# Altium schematic sheet S1_Connections.SchDoc
size A4
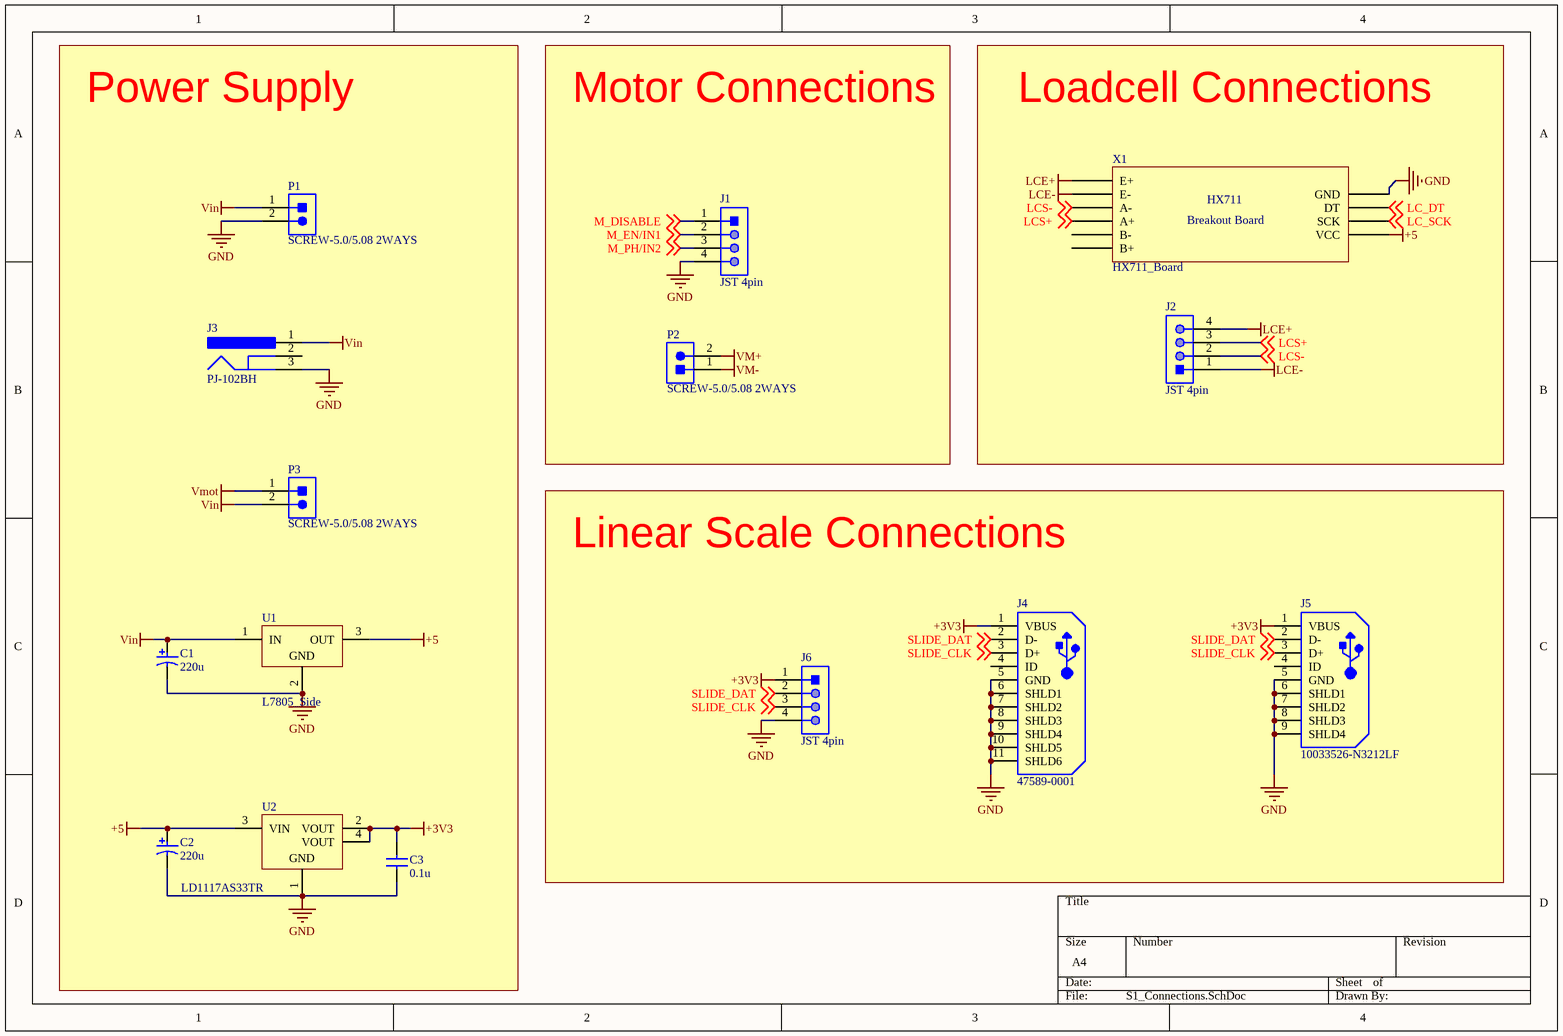
[diagram p0: S1_Connections.SchDoc]

## Parts
C1  220u  [Alu Cap 6.3x2.5mm]
C2  220u  [Alu Cap 6.3x2.5mm]
C3  0.1u  [Ceramic Cap 5mm]
J1  JST 4pin  [4Pin JST]
J2  JST 4pin  [4Pin JST]
J3  PJ-102BH  [CUI-PJ-102BH_V]
J4  47589-0001  [MOLX-47589-0001_V]
J5  10033526-N3212LF  [FCI-10033526-N3212LF_V]
J6  JST 4pin  [4Pin JST]
P1  SCREW-5.0/5.08 2WAYS  [SCREW-5.0-2WAYS_V]
P2  SCREW-5.0/5.08 2WAYS  [SCREW-5.0-2WAYS_V]
P3  SCREW-5.0/5.08 2WAYS  [SCREW-5.0-2WAYS_V]
U1  L7805_Side  [TO220_Side Mount]
U2  LD1117AS33TR  [SOT-223_M]
X1  HX711_Board  [HX711_Board_Large]

## Blocks framed on the sheet
Power Supply: C1-C3 J3 P1 P3 U1 U2
Motor Connections: J1 P2
Loadcell Connections: J2 X1
Linear Scale Connections: J4-J6

## Nets
+3V3: C3.1 J4.1(VBUS) J5.1(VBUS) J6.1 U2.2(VOUT) U2.4(VOUT)
+5: C2.1 U1.3(OUT) U2.3(VIN) X1.7(VCC)
GND: C1.2 C2.2 C3.2 J1.4 J3.3 J4.5(GND) J4.6(SHLD1) J4.7(SHLD2) J4.8(SHLD3) J4.9(SHLD4) J4.10(SHLD5) J4.11(SHLD6) J5.5(GND) J5.6(SHLD1) J5.7(SHLD2) J5.8(SHLD3) J5.9(SHLD4) J6.4 P1.2 U1.2(GND) U2.1(GND) X1.10(GND)
LCE+: J2.4 X1.1(E+)
LCE-: J2.1 X1.2(E-)
Vin: C1.1 J3.1 P1.1 P3.2 U1.1(IN)
VM+: P2.2
VM-: P2.1
Vmot: P3.1
LC_DT: X1.9(DT) ; off-sheet LC_DT
LC_SCK: X1.8(SCK) ; off-sheet LC_SCK
LCS+: J2.3 X1.4(A+) ; off-sheet LCS+
LCS-: J2.2 X1.3(A-) ; off-sheet LCS-
M_DISABLE: J1.1 ; off-sheet M_DISABLE
M_EN/IN1: J1.2 ; off-sheet M_EN/IN1
M_PH/IN2: J1.3 ; off-sheet M_PH/IN2
SLIDE_CLK: J4.3(D+) J5.3(D+) J6.3 ; off-sheet SLIDE_CLK
SLIDE_DAT: J4.2(D-) J5.2(D-) J6.2 ; off-sheet SLIDE_DAT

Not connected (* = marked no-connect by the designer): J3 2; J4 4(ID); J5 4(ID); X1 5(B-) 6(B+)

## Notes on the sheet
- (in symbol HX711_Board) HX711; Breakout Board

## Library data of the parts
C1 C2 = Polar Cap
C3 = Cap
J1 J2 J6 = 4Pin JST
J3 = CMP-2000-06901-1: Through Hole Right Angle DC Power Jack, 5 A, 2.5 mm Center Pin, 3 Position, -25 to 85 degC, RoHS, Bulk; Manufacturer: CUIInc.; Outside Contact Diameter: 6.5mm; Current Rating: 5A; Brand: CUI; Insulation Resistance: 100MOhms; Inside Contact Diameter: 2.5mm; Voltage Rating: 24V; Operating Temperature Range: -25Cto+85C; Mounting Angle: Right; Mounting Technology: ThroughHole; Product Category: DCPowerConnectors; Datasheet Version: Rev. 1.02, 05/2016; Connector Type: DCPowerJack; Contact Material: Copper; Housing Material: PolybutyleneTerephthalate(PBT); Mounting Style: ThroughHole; Product: Jacks; Package Reference: PJ-102BH; Manufacturer URL: http://www.cui.com/; RoHS: True; Contact Gender: Male; Contact Plating: Nickel; Flammability Rating: UL94V-0; Factory Pack Quantity: 280; Datasheet URL: http://www.cui.com/product/resource/pj-102bh.pdf; Package Description: 3-Pin Through Hole Device, Body 14.4 x 9 mm, Height 11 mm; Termination Style: ThroughHole
J4 = CMP-2000-05610-1: Right Angle Female Type AB Micro USB Connector, 30 V, 1.8 A, -30 to 85 degC, RoHS, Tape and Reel; Number of Ports: 1Port; Current Rating: 1.8A; Brand: Molex; Connector Type: MicroUSBTypeABreceptacle; Number of Contacts: 5Contact; Voltage Rating: 30VAC; Color: Black; Product: MicroUSBTypeABConnectors; Package URL: http://www.molex.com/pdm_docs/sd/475890001_sd.pdf; Contact Plating: Gold; Datasheet URL: http://www.molex.com/webdocs/datasheets/pdf/en-us/0475890001_IO_CONNECTORS.pdf; Operating Temperature Range: -20Cto+85C; Termination Style: SMD/SMT; Mounting Angle: Right; Package Reference: 47589-0001; Gender: Female; Package Description: Micro USB Connector, Pitch 0.65 mm, 5 Positions, Body 7.5 x 5.6 mm; Mounting Technology: SurfaceMount; Contact Material: CopperAlloy; Packaging: Reel; RoHS: True; Standard: USB; Manufacturer URL: http://www.molex.com/; Manufacturer: Molex; Datasheet Version: 12/2016; Product Category: USBConnectors; Series: 47589
J5 = CMP-1698-00001-2: Mini USB B-Type, 5-Pin SMD, RoHS, Tape and Reel; Manufacturer: FCI; Mounting Angle: Right; Number of Ports: 1 Port; Number of Contacts: 5 Contact; Connector Type: Mini USB Type B Receptacle; Gender: Female; Insulation Resistance: 100 MOhms; PartNumber: 10033526-N3212LF; DatasheetVersion: Rev. N; Termination Style: Solder Pad; Packaging: Reel; Shell Plating: Nickel; Standard: USB; Color: Black; ComponentLink1Description: Manufacturer URL; Mounting Technology: Surface Mount; Factory Pack Quantity: 750; Contact Material: Copper Alloy; Product Category: USB Connectors; ComponentLink2URL: http://portal.fciconnect.com/Comergent//fci/drawing/10033526.pdf; Flammability Rating: UL 94 V-0; Product: Mini USB Type B Connectors; Contact Plating: Gold; ComponentLink2Description: Datasheet; Brand: FCI; RoHS: Details; ComponentLink1URL: http://portal.fciconnect.com/; PackageDescription: 5-Pin Surface Mount Device, Body 9.2 x 7.7 mm, Pitch 0.8 mm
P1-P3 = CMP-0617-00009-1: Socket, Screw Terminal Block, 2 Way, 5.0 mm Pitch, 90 Degree Angle, Through-Hole; Manufacturer: No Vendor; Insulation Resistance: 5000 MOhm / 1000 V; Contact Resistance: 20 mOhm; Rated Current: 25 A; Poles: 2; Rated Voltage: 300 V; PartNumber: SCREW-5.0/5.08 2WAYS; ComponentLink1Description: Datasheet; ComponentLink1URL: 5mm screw terminal in SVN; Mounting Technology: Through Hole; PackageDescription: Socket, Screw Terminal Block, 2 Way, Pitch 5 mm, 90 Degree Angle, Through-Hole; Temperature Range: -40 to 105 degC
U2 = CMP-0244-00316-1: 1A, Low Drop Positive Voltage Regulator, 3.3V, 4-Pin SOT-223, Tape and Reel; ComponentLink1Description: Manufacturer URL; DatasheetVersion: 2/12/2011; PackageVersion: 2010; ComponentLink1URL: http://www.st.com; ComponentLink2Description: Datasheet; ComponentLink2URL: http://www.st.com/internet/com/TECHNICAL_RESOURCES/TECHNICAL_LITERATURE/DATASHEET/CD00002116.pdf; PackageDescription: 4-Pin SOT-223 Package, 6.5 x 3.5 mm Body, 2.3 mm Pitch, 7 mm Lead Span; PackageReference: SOT-223